# EAGLE design ig-normal-ver13_PWM_UARTexpantion (EAGLE 9.6.2)
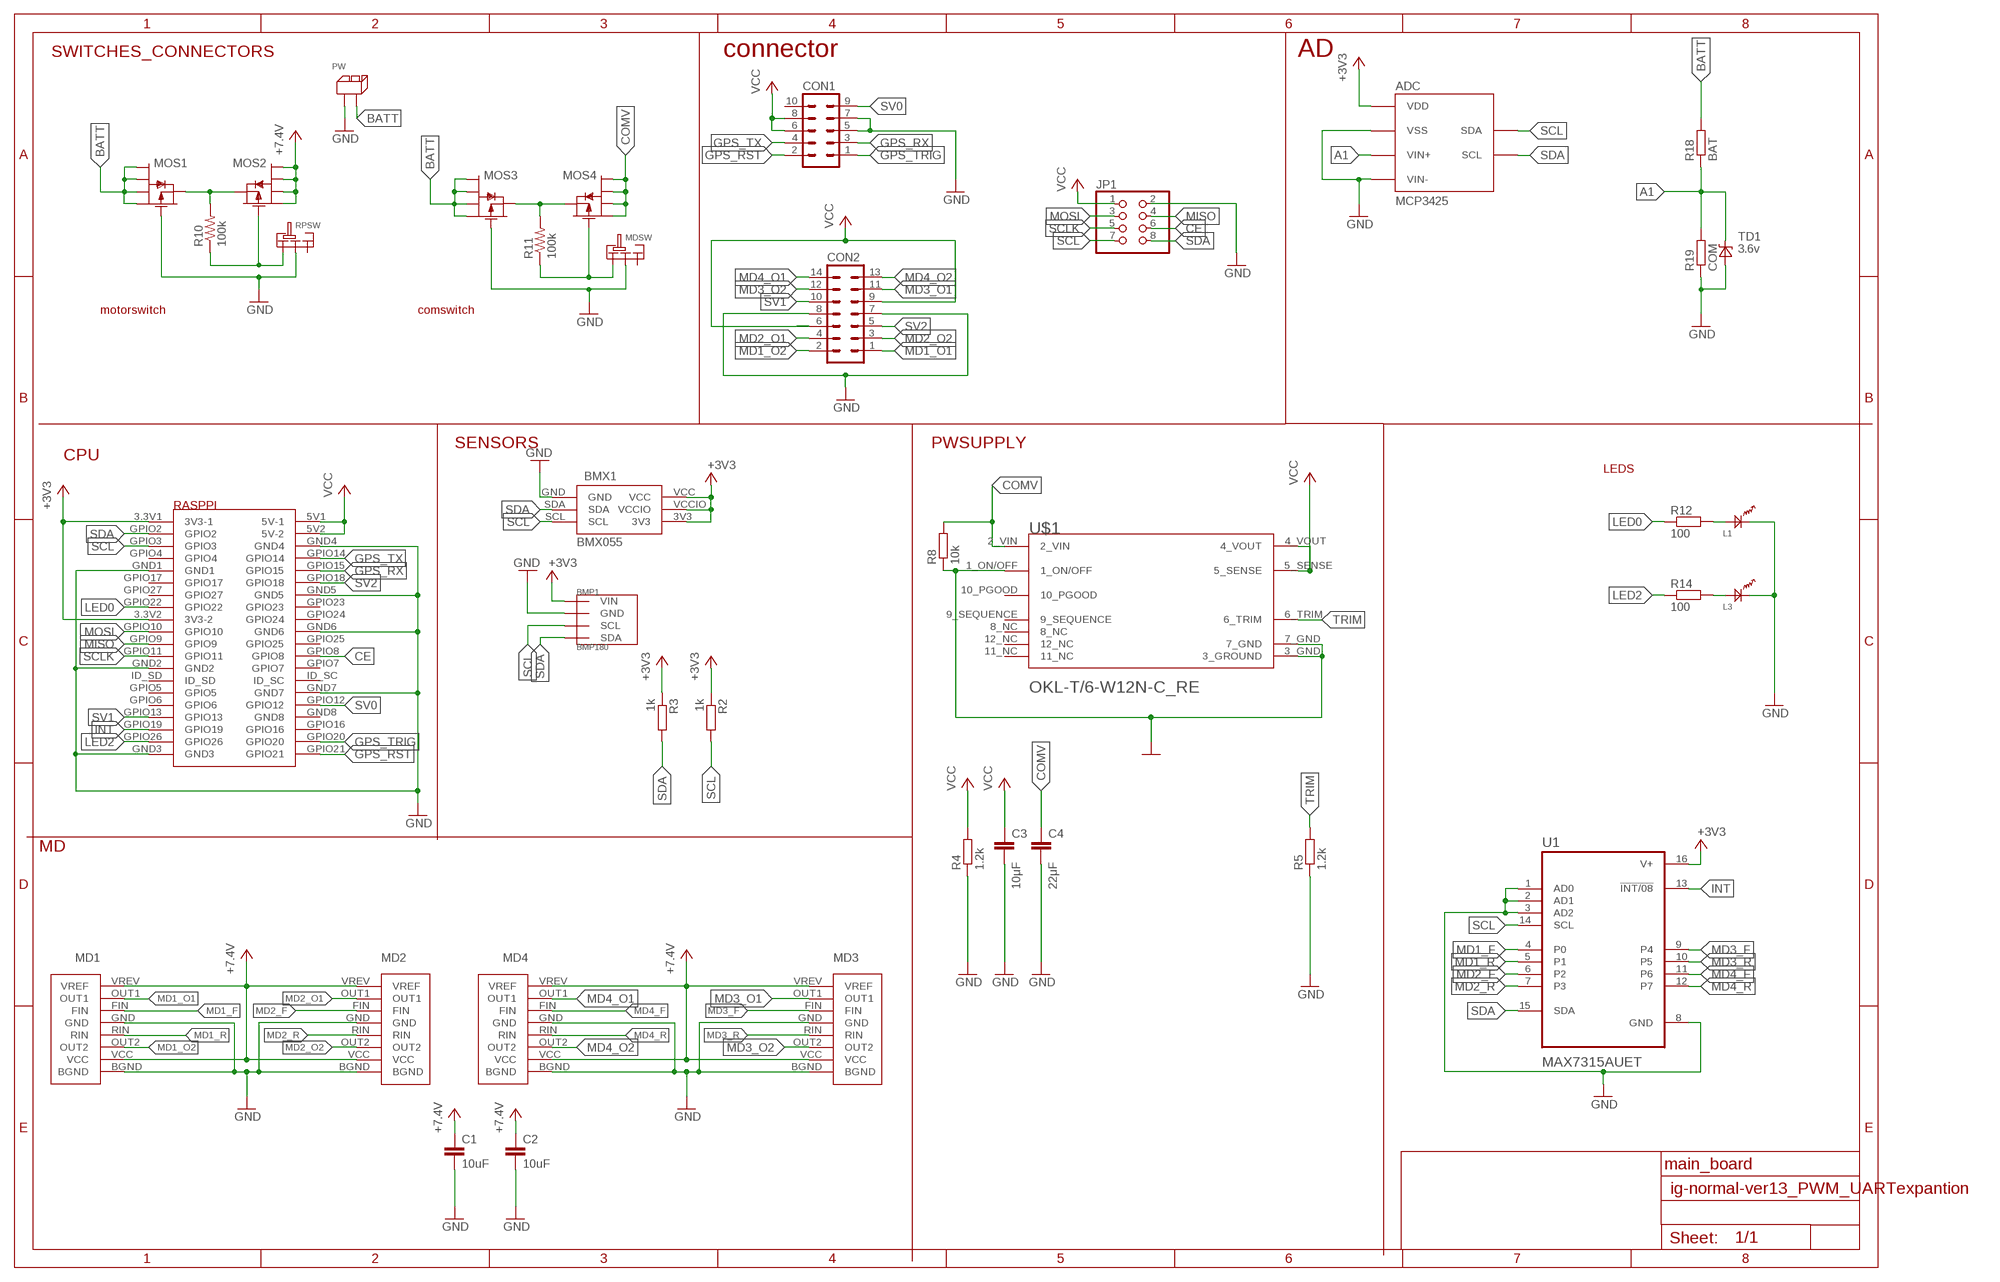
[diagram p0: schematic, sheet 1]

## Parts
ADC  MCP3425  [SOT23-6]
BMP1  BMP180  [GY-68]
BMX1  BMX055  [BMX055]
C1  10uF  C-EUC0603  [C0603]
C2  10uF  C-EUC0603  [C0603]
C3  10μF  C-EUC0603  [C0603]
C4  22μF  C-EUC0805  [C0805]
CON1  ML10L  [ML10L]
CON2  ML14L  [ML14L]
JP1  PINHD-2X4  [2X04]
L1  OSXX1608C1A  [OSXX1608C1A]
L3  OSXX1608C1A  [OSXX1608C1A]
MD1  BD6222HFP-TR  [BD6222HFP-TR]
MD2  BD6222HFP-TR  [BD6222HFP-TR]
MD3  BD6222HFP-TR  [BD6222HFP-TR]
MD4  BD6222HFP-TR  [BD6222HFP-TR]
MDSW  SRIDE_SWITCH  [SRIDE_SWITCH]
MOS1  PCH_SSM6J808R  [SSM6J808R]
MOS2  PCH_SSM6J808R  [SSM6J808R]
MOS3  PCH_SSM6J808R  [SSM6J808R]
MOS4  PCH_SSM6J808R  [SSM6J808R]
PW  2PIN  [2PIN]
R2  1k  R-EU_R0603  [R0603]
R3  1k  R-EU_R0603  [R0603]
R4  1.2k  R-EU_R0603  [R0603]
R5  1.2k  R-EU_R0603  [R0603]
R8  10k  R-EU_R0603  [R0603]
R10  100k  R-US_R0603  [R0603]
R11  100k  R-US_R0603  [R0603]
R12  100  R-EU_R0603  [R0603]
R14  100  R-EU_R0603  [R0603]
R18  BAT  R-EU_R0603  [R0603]
R19  COM  R-EU_R0603  [R0603]
RASPPI  RASPBERYPIZEROW  [RASPBERYPIZEROW]
RPSW  SRIDE_SWITCH  [SRIDE_SWITCH]
TD1  3.6v  UDZV3.6B  [UDZV3.6V]
U1  MAX7315AUET  [SOP65P640X110-16N]
U$1  OKL-T/6-W12N-C_RE  [MURATA_IKL-T-6-W12N-C_0_RECOMENDED]

## Nets
+3V3: ADC.5(VDD) BMP1.P1(VIN) BMX1.3V3 BMX1.VCC BMX1.VCCIO R2.1 R3.1 RASPPI.3.3V1(3V3-1) RASPPI.3.3V2(3V3-2) U1.16(V+)
+5V: C3.1 CON1.6 CON1.8 CON2.6 CON2.9 JP1.1 R4.2 RASPPI.5V1(5V-1) RASPPI.5V2(5V-2) U$1.4_VOUT U$1.5_SENSE ; supply symbol labelled VCC
+7.4V: C1.1 C2.1 MD1.VCC MD1.VREV(VREF) MD2.VCC MD2.VREV(VREF) MD3.VCC MD3.VREV(VREF) MD4.VCC MD4.VREV(VREF) MOS2.1 MOS2.2 MOS2.5 MOS2.6
A1: ADC.1(VIN+) R18.1 R19.2 TD1.C
BATT: MOS1.1 MOS1.2 MOS1.5 MOS1.6 MOS3.1 MOS3.2 MOS3.5 MOS3.6 PW.P$2 R18.2
CE: JP1.6 RASPPI.GPIO8
COMV: C4.1 MOS4.1 MOS4.2 MOS4.5 MOS4.6 R8.2 U$1.2_VIN
GND: ADC.2(VSS) ADC.6(VIN-) BMP1.P2(GND) BMX1.GND C1.2 C2.2 C3.2 C4.2 CON1.5 CON1.7 CON2.7 CON2.8 JP1.2 L1.CT L3.CT MD1.BGND MD1.GND MD2.BGND MD2.GND MD3.BGND MD3.GND MD4.BGND MD4.GND MDSW.LR MOS1.3 MOS3.3 PW.P$1 R4.1 R5.1 R8.1 R19.1 RASPPI.GND1 RASPPI.GND2 RASPPI.GND3 RASPPI.GND4 RASPPI.GND5 RASPPI.GND6 RASPPI.GND7 RPSW.LR TD1.A U1.1(AD0) U1.2(AD1) U1.3(AD2) U1.8(GND) U$1.1_ON/OFF U$1.3_GND(3_GROUND) U$1.7_GND
GPS_RST: CON1.2 RASPPI.GPIO21
GPS_RX: CON1.3 RASPPI.GPIO15
GPS_TRIG: CON1.1 RASPPI.GPIO20
GPS_TX: CON1.4 RASPPI.GPIO14
INT: RASPPI.GPIO19 U1.13(!INT/08)
LED0: R12.1 RASPPI.GPIO22
LED2: R14.1 RASPPI.GPIO26
MD1_F: MD1.FIN U1.4(P0)
MD1_O1: CON2.1 MD1.OUT1
MD1_O2: CON2.2 MD1.OUT2
MD1_R: MD1.RIN U1.5(P1)
MD2_F: MD2.FIN U1.6(P2)
MD2_O1: CON2.4 MD2.OUT1
MD2_O2: CON2.3 MD2.OUT2
MD2_R: MD2.RIN U1.7(P3)
MD3_F: MD3.FIN U1.9(P4)
MD3_O1: CON2.11 MD3.OUT1
MD3_O2: CON2.12 MD3.OUT2
MD3_R: MD3.RIN U1.10(P5)
MD4_F: MD4.FIN U1.11(P6)
MD4_O1: CON2.14 MD4.OUT1
MD4_O2: CON2.13 MD4.OUT2
MD4_R: MD4.RIN U1.12(P7)
MISO: JP1.4 RASPPI.GPIO9
MOSI: JP1.3 RASPPI.GPIO10
N$1: MOS3.4 MOS4.4 R11.2
N$2: MDSW.L MOS4.3 R11.1
N$3: L1.AN R12.2
N$5: L3.AN R14.2
N$6: MOS1.4 MOS2.4 R10.2
N$7: MOS2.3 R10.1 RPSW.L
SCL: ADC.4(SDA) BMP1.P3(SCL) BMX1.SCL JP1.7 R2.2 RASPPI.GPIO3 U1.14(SCL)
SCLK: JP1.5 RASPPI.GPIO11
SDA: ADC.3(SCL) BMP1.P4(SDA) BMX1.SDA JP1.8 R3.2 RASPPI.GPIO2 U1.15(SDA)
SV0: CON1.9 RASPPI.GPIO12
SV1: CON2.10 RASPPI.GPIO13
SV2: CON2.5 RASPPI.GPIO18
TRIM: R5.2 U$1.6_TRIM
Unconnected: CON1.10 MDSW.R RASPPI.GND8 RASPPI.GPIO4 RASPPI.GPIO5 RASPPI.GPIO6 RASPPI.GPIO7 RASPPI.GPIO16 RASPPI.GPIO17 RASPPI.GPIO23 RASPPI.GPIO24 RASPPI.GPIO25 RASPPI.GPIO27 RASPPI.ID_SC RASPPI.ID_SD RPSW.R U$1.8_NC U$1.9_SEQUENCE U$1.10_PGOOD U$1.11_NC U$1.12_NC

## Notes on the sheet
- SWITCHES_CONNECTORS | connector | AD
- motorswitch | comswitch
- SENSORS | PWSUPPLY
- CPU
- LEDS
- MD
- main_board

## Library data of the parts
ADC = bt:MCP3425: Microchip MCP3425 ADC The MCP3425 is a single channel low-noise, high accuracy ?? A/D converter with differential inputs and up to 16 bits of resolution in a small SOT-23-6 package. The on-board precision 2.048V reference voltage enables an input range of ±2.048V differentially (? voltage = 4.096V). The device uses a two-wire I2C compatible serial interface and operates from a single 2.7V to 5.5V power supply. The MCP3425 device performs conversion at rates of 15, 60, or 240 samples per second (SPS) depending on the user controllable configuration bit settings using the two-wire I2C serial interface Reference: http://ww1.microchip.com/downloads/en/DeviceDoc/22072a.pdf
BMP1 = BMP180:BMP180
BMX1 = BMX055:BMX055
C1-C4 = rcl:C-EU: CAPACITOR, European symbol; SPICEPREFIX: C
CON1 = con-ml:ML10L
CON2 = con-ml:ML14L
JP1 = pinhead:PINHD-2X4: PIN HEADER
L1 L3 = Chip LED:OSXX1608C1A
MD1-MD4 = BD6222HFP-TR:BD6222HFP-TR
MDSW RPSW = Sride Switch:SRIDE_SWITCH
MOS1-MOS4 = Chip MOSFET:PCH_SSM6J808R
PW = XR Connector:2PIN
R2-R5 R8 R12 R14 R18 R19 = rcl:R-EU_: RESISTOR, European symbol; SPICEPREFIX: R
R10 R11 = rcl:R-US_: RESISTOR, American symbol; SPICEPREFIX: R
RASPPI = RaspberyPiZeroW:RASPBERYPIZEROW
TD1 = Zener:UDZV3.6B
U1 = MAX7315AUET:MAX7315AUET
U$1 = OKL-T_6-W12N-C:OKL-T/6-W12N-C_RE

## Board
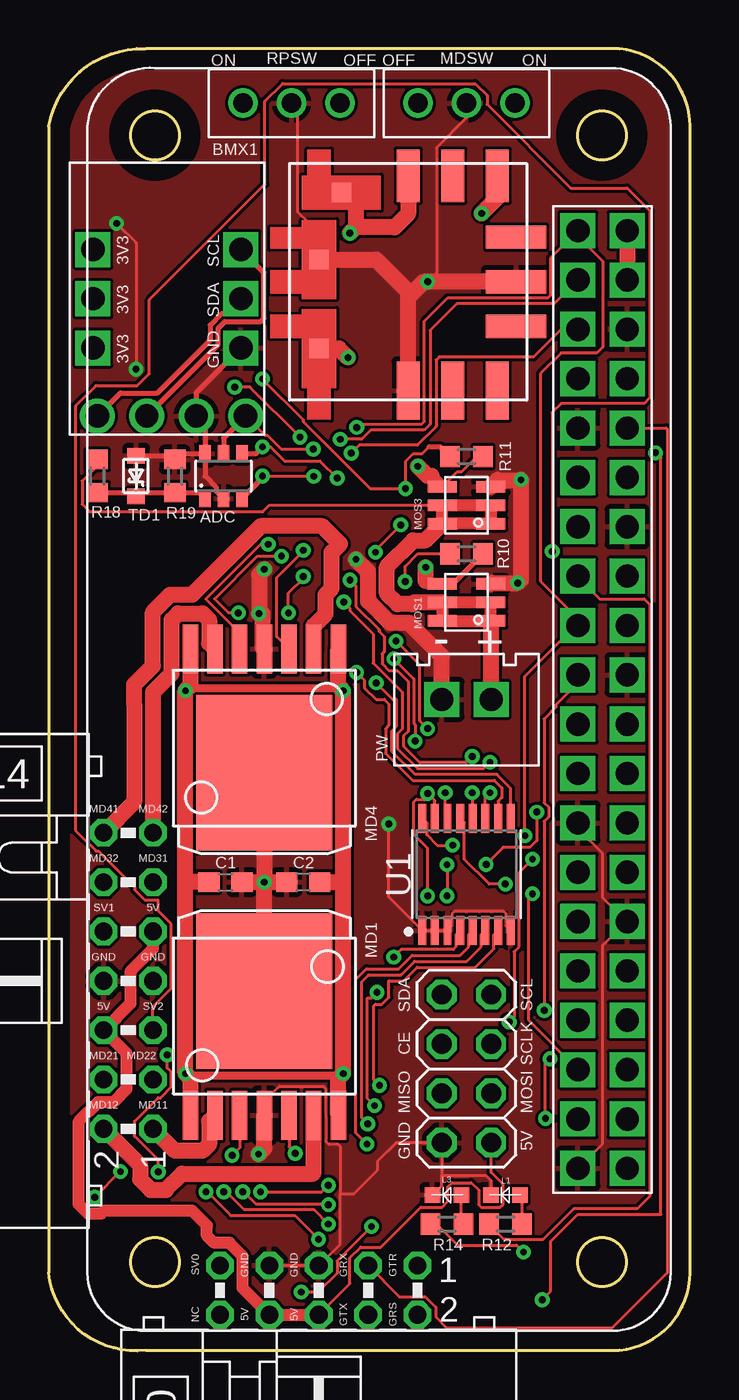
[diagram p1: board, top side]
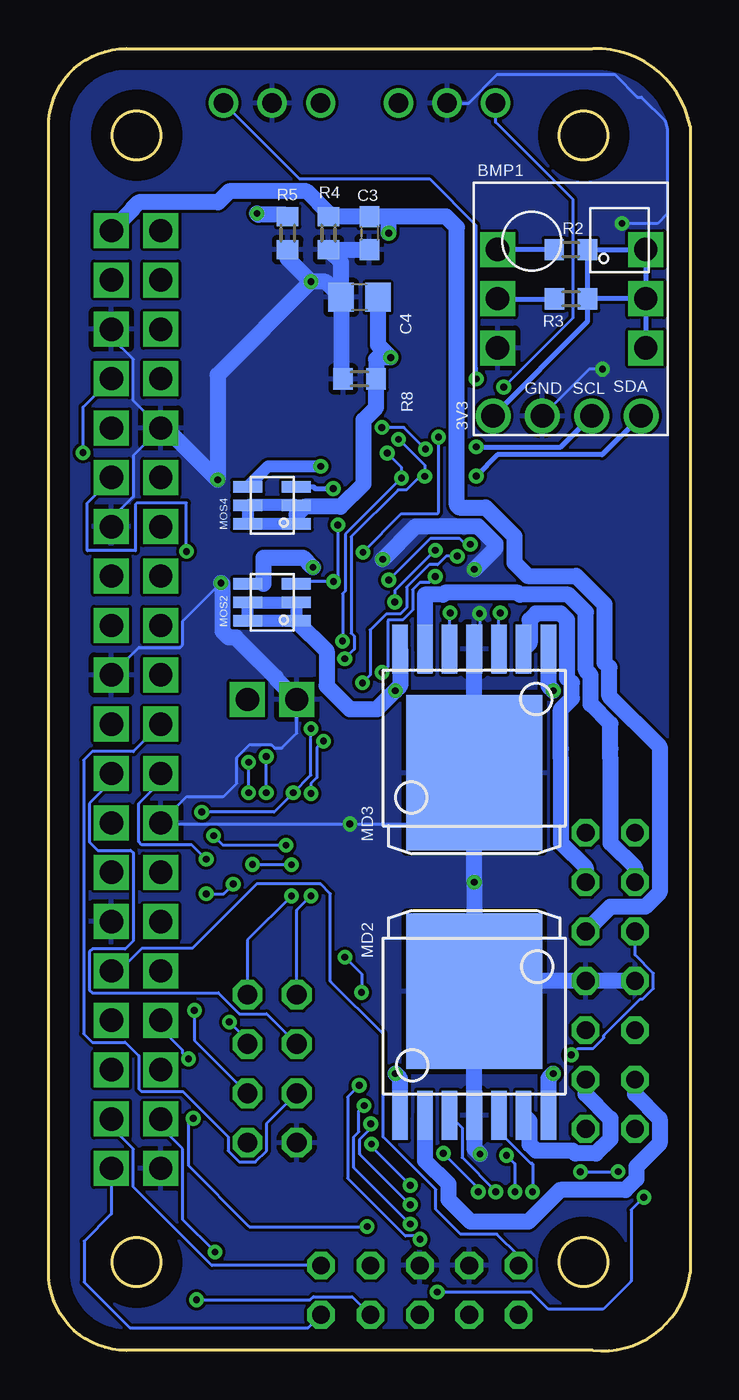
[diagram p2: board, bottom side, seen from below]

Size 33 x 67.03 mm. Coordinates in mm from the lower left corner, seen from the top.
Outline: 33,4.03 33,63.03 arc90 29,67.03 5,67.03 arc81 0,63.03 0,4.03 arc90 5,0.03 29,0.03 arc90 33,4.03
Outline: circle at 28.47,4.56 radius 1.25
Outline: circle at 5.47,4.56 radius 1.25
Outline: circle at 5.47,62.56 radius 1.25
Outline: circle at 28.47,62.56 radius 1.25
Copper layers (1*16): Top 0.035mm / dielectric 1.5mm / Bottom 0.035mm
Design rules "default *": minimum track width 6mil, minimum drill 0.35mm, track to track 6mil, track to pad 6mil, pad to pad 6mil, via to via 6mil, smd to smd 6mil, copper to edge 40mil, drill to drill 3mil, minimum pad ring 10mil, minimum via ring 8mil, stop-mask expansion 4mil, vias tented up to drill 0mil, thermal gap 10mil

### Footprints (pad centres in the part's own frame; a part is rotated, then mirrored left to right if it is on the bottom)
SOT23-6 = smd 0.6 x 0.9: 1 -0.95,-1.15; 2 0,-1.15; 3 0.95,-1.15; 4 0.95,1.15; 5 0,1.15; 6 -0.95,1.15
GY-68 = drill 1.2: P1 -5,4; P2 -5,1.46; P3 -5,-1.08; P4 -5,-3.62
BMX055 = drill 1.2 pad 1.5 square: 3V3 8.81,-9.53; GND 1.19,-4.46; SCL 1.19,-9.53; SDA 1.19,-7; VCC 8.81,-4.46; VCCIO 8.81,-7
C0603 = smd 1.1 x 1: 1 -0.85,0; 2 0.85,0
C0805 = smd 1.3 x 1.5: 1 -0.95,0; 2 0.95,0
ML10L = drill 0.914 octagon: 1 -5.08,-1.27; 2 -5.08,1.27; 3 -2.54,-1.27; 4 -2.54,1.27; 5 0,-1.27; 6 0,1.27; 7 2.54,-1.27; 8 2.54,1.27; 9 5.08,-1.27; 10 5.08,1.27
ML14L = drill 0.914 octagon: 1 -7.62,-1.27; 2 -7.62,1.27; 3 -5.08,-1.27; 4 -5.08,1.27; 5 -2.54,-1.27; 6 -2.54,1.27; 7 0,-1.27; 8 0,1.27; 9 2.54,-1.27; 10 2.54,1.27; 11 5.08,-1.27; 12 5.08,1.27; 13 7.62,-1.27; 14 7.62,1.27
2X04 = drill 1.016 octagon: 1 -3.81,-1.27; 2 -3.81,1.27; 3 -1.27,-1.27; 4 -1.27,1.27; 5 1.27,-1.27; 6 1.27,1.27; 7 3.81,-1.27; 8 3.81,1.27
OSXX1608C1A = smd 0.8 x 0.8: AN -0.75,0; CT 0.75,0
BD6222HFP-TR = smd 7 x 8: BGND 0,6.378 | smd 0.8 x 2.54: FIN -1.27,0; GND 0,0; OUT1 -2.54,0; OUT2 2.54,0; RIN 1.27,0; VCC 3.81,0; VREV -3.81,0
SRIDE_SWITCH = drill 1: L -2.5,0; LR 0,0; R 2.5,0
SSM6J808R = smd 0.6 x 1.5: 1 -0.95,-1.25; 2 0,-1.25; 3 0.95,-1.25; 4 0.95,1.25; 5 0,1.25; 6 -0.95,1.25
2PIN = drill 1.2 square: P$1 -1.27,0; P$2 1.27,0
R0603 = smd 1 x 1.1: 1 -0.85,0; 2 0.85,0
RASPBERYPIZEROW = drill 1.2 pad 1.676 square: 3.3V1 -1.27,24.13; 3.3V2 -1.27,3.81; 5V1 1.27,24.13; 5V2 1.27,21.59; GND1 -1.27,13.97; GND2 -1.27,-6.35; GND3 -1.27,-24.13; GND4 1.27,19.05; GND5 1.27,8.89; GND6 1.27,1.27; GND7 1.27,-11.43; GND8 1.27,-16.51; GPIO2 -1.27,21.59; GPIO3 -1.27,19.05; GPIO4 -1.27,16.51; GPIO5 -1.27,-11.43; GPIO6 -1.27,-13.97; GPIO7 1.27,-6.35; GPIO8 1.27,-3.81; GPIO9 -1.27,-1.27; GPIO10 -1.27,1.27; GPIO11 -1.27,-3.81; GPIO12 1.27,-13.97; GPIO13 -1.27,-16.51; GPIO14 1.27,16.51; GPIO15 1.27,13.97; GPIO16 1.27,-19.05; GPIO17 -1.27,11.43; GPIO18 1.27,11.43; GPIO19 -1.27,-19.05; GPIO20 1.27,-21.59; GPIO21 1.27,-24.13; GPIO22 -1.27,6.35; GPIO23 1.27,6.35; GPIO24 1.27,3.81; GPIO25 1.27,-1.27; GPIO26 -1.27,-21.59; GPIO27 -1.27,8.89; ID_SC 1.27,-8.89; ID_SD -1.27,-8.89
UDZV3.6V = smd 0.9 x 0.8: A 0,-1.05; C 0,1.05
SOP65P640X110-16N = smd 1.496 x 0.407: 1 -2.887,2.275; 2 -2.887,1.625; 3 -2.887,0.975; 4 -2.887,0.325; 5 -2.887,-0.325; 6 -2.887,-0.975; 7 -2.887,-1.625; 8 -2.887,-2.275; 9 2.887,-2.275; 10 2.887,-1.625; 11 2.887,-0.975; 12 2.887,-0.325; 13 2.887,0.325; 14 2.887,0.975; 15 2.887,1.625; 16 2.887,2.275
MURATA_IKL-T-6-W12N-C_0_RECOMENDED = smd 3 x 1.2: 1_ON/OFF -5.6,0; 9_SEQUENCE -5.6,-4.58; 10_PGOOD -5.6,-2.29 | smd 1 x 1: 2_VIN -3.435,4.58; 3_GND 1.145,4.58; 4_VOUT 4.585,3.435 | smd 2.7 x 1.2: 5_SENSE 5.45,0; 6_TRIM 5.45,-4.58; 11_NC 5.45,-2.29 | smd 1.2 x 3.1: 7_GND 0,-5.55; 8_NC -2.29,-5.55; 12_NC 2.29,-5.55

### Placement (x,y rotation side)
ADC  9,45.03 0 top
BMP1  6.13,53.12 90 bottom
BMX1  11.09,47.15 180 top
C1  9.1,24.13 0 top
C2  13.1,24.13 180 top
C3  16.5,57.53 270 bottom
C4  17,54.23 180 bottom
CON1  13.9,3.13 180 top
CON2  4.1,19.05 90 top
JP1  21.5,14.53 90 top
L1  23.5,8.03 180 top
L3  20.5,8.03 180 top
MD1  11.1,12.13 0 top
MD2  11.1,12.13 0 bottom
MD3  11.1,36.13 180 bottom
MD4  11.1,36.13 180 top
MDSW  21.5,64.23 180 top
MOS1  21.5,38.53 90 top
MOS2  21.5,38.53 90 bottom
MOS3  21.5,43.53 90 top
MOS4  21.5,43.53 90 bottom
PW  21.5,33.53 0 top
R2  6.13,56.68 180 bottom
R3  6.12,54.14 180 bottom
R4  18.6,57.53 90 bottom
R5  20.7,57.53 90 bottom
R8  17,50.03 0 bottom
R10  21.5,41.03 0 top
R11  21.5,46.03 0 top
R12  23.5,6.53 0 top
R14  20.5,6.53 0 top
R18  2.5,45.03 90 top
R19  6.5,45.03 270 top
RASPPI  28.5,33.53 0 top
RPSW  12.5,64.23 0 top
TD1  4.5,45.03 180 top
U1  21.5,24.53 90 top
U$1  18.5,55.03 90 top

### Tracks (layer width: path | path; a pad name or v marks a point on that pad's centre or on a via)
+3V3  (via drill 0.35 pad 0.55)
  Top 0.152: BMP1.P1 11.12,47.13 11.25,47.13 11.97,46.42 v13.61,46.42 | v15.85,47.53 16.03,47.7 19.2,47.7 19.33,47.83 19.33,52.99 20.54,54.2 25.7,54.2 25.83,54.33 25.83,56.26 RASPPI.3.3V1 27.13,57.45 28.5,56.08 28.5,51.66 28.2,51.36 26.37,51.36 25.3,50.29 25.3,39.62 27.13,37.79 27.13,37.34 | 27.13,37.34 RASPPI.3.3V2 | U1.16 19.44,27.2 19.44,26.57 19.99,26.03 v20.79,26.03 | v24.51,26.52 24.51,34.72 27.13,37.34
  Top 0.254: BMP1.P1 9,46.99 ADC.5
  Bottom 0.152: v13.61,46.42 14.72,47.53 v15.85,47.53 | v20.79,26.03 24.02,26.03 v24.51,26.52
  Bottom 0.254: BMP1.P1 5.27,52.99 R3.1 | R3.1 R2.1 BMX1.3V3 BMX1.VCCIO | BMX1.VCCIO 5.26,54.15 R3.1 | BMX1.VCCIO BMX1.VCC
+5V  (via drill 0.35 pad 0.55)
  Top 0.152: CON1.6 15.5,3.46 15.5,4.79 16.05,5.34 17.09,5.34 19.15,7.4 20.24,7.4 20.54,7.69 20.54,8.43 20.75,8.66 21.75,8.66 22.12,8.28 22.12,7.53 22.25,7.4 23.25,7.4 23.38,7.53 23.38,8.58 22.77,9.19 JP1.1
  Top 0.61: CON1.6 CON1.8 9.99,3.23 9.99,4.88 9.3,5.56 8.5,5.56 8.14,5.93 8.14,6.46 7.36,7.23 2.88,7.23 2.72,7.07 2.03,7.07 1.54,7.56 1.54,11.79 2.55,12.8 3.31,12.8 4,13.48 4,15.34 CON2.6 4.2,17.88 4.2,19.53 5.37,20.7 CON2.9
  Top 0.813: RASPPI.5V1 RASPPI.5V2 | 15.8,57.83 v15.5,57.53 | 15.8,57.83 17.8,57.83 18.5,58.53 U$1.5_SENSE | U$1.4_VOUT 15.8,58.88 15.8,57.83
  Bottom 0.813: RASPPI.5V1 28.69,58.74 28.69,58.79 28.36,59.12 24.28,59.12 23.71,59.69 19.72,59.69 18.6,58.57 R4.2 C3.1 15.5,58.38 | 15.5,58.38 12.55,58.38 12,57.83 12,43.53 11.88,43.42 10.52,43.42 9.04,41.93 9.04,40.57 8.35,39.89 5.86,39.89 4.39,38.42 4.39,35.43 4.15,35.18 4.15,33.68 1.56,31.1 1.56,23.6 2.3,22.86 4.1,22.86 CON2.9 | v15.5,57.53 15.5,58.38
+7.4V  (via drill 0.35)
  Top 0.406: v15.16,33.98 14.87,33.98 14.75,34.1 7.45,34.1 7.33,33.98 v7.04,33.98 | v15.16,14.27 14.87,14.27 14.75,14.15 7.45,14.15 7.33,14.27 v7.04,14.27
  Top 0.813: MD4.VCC 7.29,34.23 v7.04,33.98 7.04,24.13 | MD2.VCC 7.29,14.02 v7.04,14.27 7.04,24.13 | MD1.VCC 14.91,14.02 v15.16,14.27 15.16,24.13 | MD3.VCC 14.91,34.23 v15.16,33.98 15.16,24.13 | C2.1 15.16,24.13 | C1.1 7.04,24.13
  Bottom 0.61: MOS2.1 MOS2.6 MOS2.5 MOS2.2 MOS2.1
  Bottom 0.813: MD4.VCC 7.29,34.23 v7.04,33.98 | v7.04,14.27 7.29,14.02 MD2.VCC | MD1.VCC 14.91,14.02 v15.16,14.27 | MD3.VCC 14.91,34.23 v15.16,33.98 16.11,33.03 17.5,33.03 18.7,34.23 18.7,36.03 MOS2.1
A1
  Top 0.254: R18.1 4.3,44.18 TD1.C 4.7,44.18 R19.2 7.75,44.18 ADC.1
BATT
  Top 0.152: MOS3.5 11.36,43.53 11.03,43.2 2.11,43.2 1.72,43.58 1.72,44.77 2.5,45.55 R18.2
  Top 0.61: MOS1.6 MOS1.1 MOS1.2 MOS1.5 MOS1.6 | MOS3.1 MOS3.6 MOS3.5 MOS3.2 MOS3.1
  Top 0.813: PW.P$2 22.77,37.56 MOS1.1 | MOS1.5 18.82,38.53 18.73,38.43 17.95,38.43 17.41,38.98 17.41,40.36 18.76,41.71 19.39,41.71 MOS3.6
CE
  Bottom 0.152: RASPPI.GPIO8 29.77,29.3 30.9,28.17 30.9,26.18 30.48,25.77 28.77,25.77 28.64,25.63 28.64,21.1 29.06,20.69 30.77,20.69 30.9,20.55 30.9,18.56 30.77,18.43 24.26,18.43 23.18,17.35 21.78,17.35 JP1.6
COMV  (via drill 0.35 pad 0.55)
  Top 0.813: U$1.2_VIN 14.94,51.59 v15.4,51.13
  Bottom 0.61: MOS4.1 20.25,43.03 MOS4.2 MOS4.5 MOS4.6 MOS4.1
  Bottom 0.813: 20.25,43.03 19.83,43.45 17.97,43.45 16.79,44.62 16.79,47.91 16.15,48.56 R8.2 16.15,51.03 16.05,51.13 v15.4,51.13 16.05,51.78 C4.1
GND  (via drill 0.35, 0.35 pad 0.55)
  Top 0.152: U$1.3_GND 14.24,56.49 14.49,56.49 14.63,56.62 14.63,57.92 14.49,58.06 13.38,58.06 12.8,58.63 12.8,63.93 RPSW.LR | MDSW.LR 21.5,63.46 19.96,61.92 19.96,55.49 v19.5,55.03 | v3.5,58.03 4.5,57.03 v4.5,50.53 | 15,8.08 15,10.53 14.9,10.63 14.41,10.63 14.28,10.77 14.28,13.48 14.13,13.63 11.88,13.63 11.1,12.85 MD1.GND | 15,8.08 15.7,8.08 16.92,9.29 16.92,9.75 17.88,10.72 JP1.2 20.23,9.03 | L1.CT 22.75,8.04 22.75,8.77 22.5,9.03 20.23,9.03 | 29.72,22.1 28.5,23.32 28.5,25.6 27.28,26.82 27.28,27.13 RASPPI.GND2 | 29.72,22.1 28.5,20.88 28.5,10.67 RASPPI.GND3 | 29.72,22.1 RASPPI.GND7 | v10.83,37.95 11,37.95 | 15,8.08 15,5.5 CON1.5 CON1.7 | U1.8 23.56,21.86 23.56,22.48 23.42,22.62 20.88,22.62 20.74,22.48 20.74,21.86 U1.3 U1.2 U1.1 17.5,23.36 v17.5,27.13 | 20.23,9.03 20.23,8.51 L3.CT
  Top 0.254: TD1.A 6.3,46.08 R19.1 6.8,46.18 ADC.6 | ADC.2 8.63,44.25 8.63,44.44 8.05,45.02 ADC.6 | BMX1.GND 7.59,49.31 BMP1.P2 8.05,47.67 ADC.6
  Top 0.813: MD1.BGND v11.1,24.13 | MD4.BGND v11.1,24.13 | C1.2 v11.1,24.13 | v11.1,24.13 C2.2 | U$1.7_GND v19.5,55.03 19.3,55.03 18.5,54.23 | U$1.1_ON/OFF 18.5,54.23 | 18.5,54.23 18.5,54.53 16.86,56.17 U$1.3_GND | 11,37.95 11,36.23 MD4.GND | MOS1.3 22.8,39.53 v24.13,39.53 24.3,39.7 v24.3,44.83 23.1,44.83 MOS3.3 | PW.P$1 20.23,35.76 18.52,37.47 17.55,37.47 16.44,38.58 16.44,40.11 v15.81,40.74 | v11.1,40.23 10.83,39.95 v10.83,37.95 | v10.8,10.13 11.1,10.43 MD1.GND
  Bottom 0.152: RPSW.LR 11.39,64.23 9.92,65.69 3.88,65.69 2.71,64.53 2.5,64.53 1.29,63.31 1.17,62.88 1.17,58.53 1.67,58.03 v3.5,58.03 | v4.5,50.53 5.19,50.53 BMP1.P2 | RASPPI.GND4 29.77,52.16 28.64,51.03 28.64,48.91 RASPPI.GND1 28.64,46.09 28.64,43.96 29.77,42.83 RASPPI.GND5 | MD4.BGND 11.43,27.13 v17.5,27.13 27.13,27.13 RASPPI.GND2 25.88,28.53 24,28.53 23.32,29.21 23.32,30.55 22.66,31.2 21.55,31.2 21.37,31.03 21,31.03 20.23,31.8 PW.P$1 | MD4.GND 10.83,36.4 v10.83,37.95 | RASPPI.GND6 28.36,36.21 26.23,36.21 26.1,36.34 26.1,37.56 v24.13,39.53
  Bottom 0.813: MD1.BGND v11.1,24.13 MD4.BGND MD4.GND | PW.P$1 21.31,34.61 21.31,34.66 23.37,36.72 23.73,36.72 24.06,37.05 24.06,39.45 v24.13,39.53 | v15.81,40.74 14.1,42.45 10.92,42.45 10,41.53 10,41.33 v11.1,40.23 | RASPPI.GND1 26.97,47.5 v24.3,44.83 24.3,50.23 v19.5,55.03 | C4.2 18.75,55.03 v19.5,55.03 | C3.2 16.6,56.58 16.7,56.68 R4.1 17.95,56.03 C4.2 | MD1.BGND MD1.GND 11.1,11.75 11.09,11.75 11.09,10.42 v10.8,10.13 | CON2.8 CON2.7 10.56,19.05 MD1.BGND | R5.1 20.7,56.23 v19.5,55.03 | C4.2 17.95,50.13 R8.1
  pour Bottom: -1.98,69.09 36.12,69.09 36.12,-2.03 -1.98,-2.03
  pour Top: -1.98,69.09 36.12,69.09 36.12,-2.03 -1.98,-2.03
GPS_RST
  Bottom 0.152: RASPPI.GPIO21 29.77,7.04 31.17,5.65 31.17,3.54 28.83,1.2 28.82,1.19 19.64,1.19 CON1.2
GPS_RX
  Top 0.152: RASPPI.GPIO15 31.77,47.5 31.83,47.43 31.83,4.03 29,1.19 20.47,1.19 19.92,1.75 19.92,2.25 19.37,2.8 18.04,2.8 CON1.3
GPS_TRIG
  Bottom 0.152: RASPPI.GPIO20 29.77,11.52 28.64,10.39 28.64,8.44 24.6,4.4 CON1.1
GPS_TX  (via drill 0.35 pad 0.55)
  Top 0.152: v25.39,2.63 25.83,3.07 25.83,5.63 27.23,7.03 31.5,7.03 31.5,45.95 v31.23,46.23
  Bottom 0.152: v31.23,46.23 31.23,48.58 RASPPI.GPIO14 | CON1.4 17.38,2.8 19.37,2.8 19.53,2.63 v25.39,2.63
INT  (via drill 0.35)
  Top 0.152: U1.13 21.39,27.2 21.39,25.3 22.66,24.03 v23.5,24.03 | RASPPI.GPIO19 24.71,17 24.71,23.34 v24.89,23.53
  Bottom 0.152: v24.89,23.53 24,23.53 v23.5,24.03
LED0
  Top 0.152: RASPPI.GPIO22 27.28,39.77 28.35,38.71 30.63,38.71 30.94,38.4 30.94,7.96 30.3,7.33 27.04,7.33 25.45,5.75 23.5,5.75 23.43,5.75 R12.1
LED2  (via drill 0.35)
  Top 0.152: v24.43,5.09 24.08,5.44 21.06,5.44 19.98,6.53 R14.1
  Bottom 0.152: RASPPI.GPIO26 27.23,11.52 26.1,10.39 26.1,6.76 v24.43,5.09
MD1_F  (via drill 0.35 pad 0.55)
  Top 0.152: MD1.FIN 9.83,10.45 v9.44,10.06 | v9.01,8.19 9.13,8.19 10.05,7.28 13.64,7.28 v14.39,6.53 | v16.77,12.63 16.4,12.99 16.4,18.15 16.6,18.15 v16.9,18.45 | U1.4 20.96,21.42 20.96,20.8 20.82,20.66 18.15,20.66 v17.76,20.27
  Bottom 0.152: v9.44,10.06 9.01,9.63 v9.01,8.19 | v17.76,20.27 16.9,19.41 v16.9,18.45 | v14.39,6.53 17.29,9.43 17.29,11.02 17.03,11.28 17.03,12.37 v16.77,12.63
MD1_O1
  Top 0.813: MD1.OUT1 8.25,11.82 8.25,10.63 7.92,10.3 6.5,10.3 CON2.1
MD1_O2
  Top 0.813: MD1.OUT2 13.64,9.17 13.6,9.13 6.87,9.13 6.03,8.28 5.25,8.28 4.7,8.83 4.7,9.55 CON2.2
MD1_R  (via drill 0.35 pad 0.55)
  Top 0.152: MD1.RIN 12.37,10.48 v12.69,10.16 | v14.39,8.53 14.06,8.19 v10.9,8.19 | v16.38,10.64 15.79,11.23 15.79,19.11 16.34,19.66 18.01,19.66 18.7,20.36 21.17,20.36 21.61,20.8 21.61,21.42 U1.5
  Bottom 0.152: v12.69,10.16 10.9,8.38 v10.9,8.19 | v14.39,8.53 16.38,10.52 v16.38,10.64
MD2_F  (via drill 0.35 pad 0.55)
  Top 0.152: v9.99,8.19 10.04,8.19 10.65,7.58 14.34,7.58 v14.39,7.53 | v16.43,11.69 16.1,12.01 16.1,18.99 16.47,19.36 18.13,19.36 18.83,20.05 21.51,20.05 22.26,20.8 22.26,21.42 U1.6
  Bottom 0.152: MD2.FIN 11.73,11.49 11.73,9.96 9.99,8.22 v9.99,8.19 | v16.43,11.69 16.43,11.46 16.99,10.9 16.99,10.12 v14.39,7.53
MD2_O1
  Bottom 0.813: MD2.OUT1 13.64,9.79 12.44,8.59 12.44,7.8 11.29,6.65 8.31,6.65 6.68,8.28 3.32,8.28 2.76,8.84 2.76,9.48 1.56,10.68 1.56,11.95 2.83,13.22 CON2.4
MD2_O2
  Bottom 0.813: MD2.OUT2 8.25,11.82 8.25,10.63 7.92,10.3 6.04,10.3 5.9,10.16 4.84,10.16 4.1,10.9 4.1,11.95 5.37,13.22 CON2.3
MD2_R  (via drill 0.35 pad 0.55)
  Top 0.152: v8.1,8.19 8.15,8.19 9.37,6.97 12.66,6.97 v13.89,5.74 | v17.02,13.66 16.71,13.97 16.71,17.73 16.82,17.84 17.15,17.84 17.51,18.2 17.51,18.7 17.5,18.71 17.5,19.03 17.53,19.05 18.26,19.05 18.96,19.75 21.95,19.75 22.91,20.7 22.91,21.42 U1.7
  Bottom 0.152: MD2.RIN 9.83,11.31 8.18,9.66 8.14,9.66 8.1,9.63 v8.1,8.19 | v13.89,5.74 14.06,5.92 14.64,5.92 17.62,8.89 17.62,13.06 v17.02,13.66
MD3_F  (via drill 0.35 pad 0.55)
  Top 0.152: v11.98,40.9 10.75,40.9 8.55,38.7 9.26,37.98 v9.76,37.98 | v16.86,34.38 17.71,33.53 17.88,33.53 17.88,32.13 17.64,31.89 17.64,30.88 18.85,29.67 23.06,29.67 23.77,28.95 U1.9
  Bottom 0.152: MD3.FIN 9.83,37.92 v9.76,37.98 | v11.98,40.9 12.55,40.9 12.99,40.46 13.43,40.46 14.58,39.31 14.58,38.25 14.9,37.93 15.63,37.93 16.45,37.1 16.45,34.78 v16.86,34.38
MD3_O1
  Bottom 0.813: MD3.OUT1 8.25,36.43 8.25,37.62 7.92,37.96 6.66,37.96 6.32,37.62 6.32,34.63 6.08,34.38 6.08,33.58 6.64,33.02 6.64,30.99 6.64,30.48 6.64,26.14 5.37,24.87 CON2.11
MD3_O2
  Bottom 0.813: MD3.OUT2 13.64,38.92 12.71,38.92 12.61,39.03 8.86,39.03 8.75,38.92 6.26,38.92 5.36,38.02 5.36,35.03 5.11,34.78 5.11,33.28 4.1,32.27 4.1,30.99 4.1,30.48 4.1,26.14 2.83,24.87 CON2.12
MD3_R  (via drill 0.35 pad 0.55)
  Top 0.152: v12.34,37.98 12.34,39 13.1,39.76 v13.1,39.86 | v15.85,34.92 16.25,34.52 16.25,34.13 16.85,33.53 17.28,33.53 17.5,33.31 17.5,32.18 17.34,32.01 17.34,30.75 18.73,29.36 22.93,29.36 23.32,28.98 23.32,28.48 23.12,28.28 U1.10
  Bottom 0.152: MD3.RIN 12.37,37.96 v12.34,37.98 | v13.1,39.86 13.4,39.56 13.9,39.56 14.28,39.18 14.28,38.13 14.78,37.63 15.5,37.63 15.55,37.58 15.55,35.22 v15.85,34.92
MD4_F  (via drill 0.35 pad 0.55)
  Top 0.152: MD4.FIN 11.73,36.76 11.73,39.8 13.1,41.16 v13.1,41.21 | v15.19,38.54 15.5,38.22 15.5,38.1 16.7,36.9 16.7,35.4 18.19,33.91 18.19,32 17.95,31.76 17.95,31.01 18.98,29.97 22.38,29.97 v22.71,30.3 | U1.11 22.48,28.49 v22.71,28.73
  Bottom 0.152: v13.1,41.21 13.11,41.21 15.19,39.13 v15.19,38.54 | v22.71,28.73 v22.71,30.3
MD4_O1
  Top 0.813: MD4.OUT1 13.64,37.32 14.25,37.93 14.25,38.93 14.57,39.24 14.57,41.09 15,41.53 14.08,42.45 10.91,42.45 7.39,38.92 6.26,38.92 5.36,38.02 5.36,35.25 4.41,34.3 4.41,33.53 4.41,33.32 4.41,28.24 CON2.14
MD4_O2
  Top 0.813: MD4.OUT2 8.25,36.43 8.25,37.62 7.92,37.96 6.66,37.96 6.32,37.62 6.32,34.85 5.37,33.9 CON2.13
MD4_R  (via drill 0.35 pad 0.55)
  Top 0.152: MD4.RIN 9.83,36.96 8.09,38.7 10.9,41.51 v11.3,41.51 | v15.5,39.68 15.8,39.37 15.8,38.32 17,37.12 17,37.03 17.27,36.76 17.27,35.99 17.16,35.87 17.16,35.37 17.51,35.01 17.94,35.01 18.49,34.46 18.49,31.88 18.25,31.64 18.25,31.13 19.11,30.28 21.48,30.28 v21.8,30.6 | U1.12 21.82,28.7 v21.8,28.73
  Bottom 0.152: v11.3,41.51 11.54,41.51 11.85,41.82 13.36,41.82 v15.5,39.68 | v21.8,28.73 v21.8,30.6
MISO
  Bottom 0.152: RASPPI.GPIO9 28.64,30.85 30.77,30.85 31.2,30.41 31.2,16.33 30.77,15.89 29.06,15.89 28.36,15.19 28.36,13.48 28.23,13.35 26.09,13.35 23.76,11.02 23.76,10.31 23.18,9.73 22.36,9.73 21.78,10.31 21.78,11.71 JP1.4
MOSI  (via drill 0.35)
  Top 0.152: RASPPI.GPIO10 27.23,34.38 26.1,33.25 26.1,33.13 25.5,32.53 25.5,28.21 25.72,27.98 25.72,27.48 25.5,27.26 v25.5,17.53
  Bottom 0.152: v25.5,17.53 25.5,15.99 JP1.3
N$1  (via drill 0.35)
  Top 0.152: R11.2 22.02,46.03 21.25,45.25 21.02,45.25 MOS3.4
  Top 0.61: MOS3.4 19.7,45.03
  Top 0.813: 19.7,45.03 19.5,45.03 v19,45.53
  Bottom 0.61: v19,45.53 v19.01,45.53 21.69,45.53 MOS4.4
N$2  (via drill 0.35, 0.35 pad 0.55)
  Top 0.152: v11,50.03 13.09,47.94 13.09,47.83 16.54,44.38 v18.36,44.38 18.36,45.78 18.74,46.16 19.2,46.16 19.57,46.53
  Top 0.254: R11.1 20.15,46.53 19.57,46.53
  Bottom 0.152: MDSW.L 20.09,60.32 13.4,60.32 11.03,57.95 11.03,50.62 11,50.59 v11,50.03
  Bottom 0.254: v18.36,44.38 18.71,44.38 18.73,44.37 19.27,44.37 19.38,44.48 MOS4.3
N$3
  Top 0.152: L1.AN 24.35,7.93 R12.2
N$5
  Top 0.152: L3.AN 21.23,7.89 21.23,6.67 R14.2
N$6  (via drill 0.35)
  Top 0.254: MOS1.4 20.8,39.48 R10.2
  Top 0.61: MOS1.4 19.55,39.48 19.4,39.63
  Top 0.813: 19.4,39.63 v19.4,40.33
  Bottom 0.61: 21.95,39.48 MOS2.4
  Bottom 0.813: v19.4,40.33 19.9,40.83 21.95,40.83 21.95,39.48
N$7  (via drill 0.35, 0.35 pad 0.55)
  Top 0.152: v12.94,47.03 10.36,49.61 v9.58,49.61 | v18.12,42.51 16.82,41.22 v16.82,41.11 | v18.34,39.59 18.34,40.37 19,41.03 R10.1
  Bottom 0.152: v12.94,47.03 12.94,43.15 13,43.09 14.84,43.09 v16.82,41.11 | v9.58,49.61 6.01,53.17 6.01,59.24 10,63.23 RPSW.L | v18.12,42.51 18.12,39.59 v18.34,39.59 20.13,39.59 MOS2.3
SCL  (via drill 0.35, 0.35 pad 0.55)
  Top 0.152: v15.57,46.21 15.98,46.61 18.97,46.61 19.94,47.58 19.94,51 20.09,51.16 24.94,51.16 26.36,52.58 RASPPI.GPIO3 | v11,46.53 11.43,46.53 12.14,45.81 13.96,45.81 v14.85,44.92 | v17.88,36.53 19.1,35.31 19.1,32.43 v19.5,32.03 | U1.14 20.41,27.53 v20.41,28.73 | v22.51,25.04 23.39,25.91 24.76,25.91 25.12,26.27 v25.12,27.73 | v20.5,25.03 v20.5,23.42
  Top 0.254: BMP1.P3 8.72,51.79 8.72,52.63 9.06,52.98 10.91,52.98 10.96,53.03 11,53.03 11,53.06 11.08,53.14 11.08,55.51 BMX1.SCL | ADC.4 10.65,46.18 v11,46.53
  Bottom 0.152: v15.57,46.21 14.85,45.48 v14.85,44.92 17.73,42.03 17.73,39.12 17.88,38.97 v17.88,36.53 | v19.5,32.03 19.5,29.64 v20.41,28.73 21.4,27.73 v25.12,27.73 | v22.51,25.04 v22.5,25.03 v20.5,25.03 | v20.5,23.42 22.77,21.15 JP1.7
  Bottom 0.254: R2.2 BMX1.SCL | v11,46.53 6.65,46.53 BMP1.P3
SCLK  (via drill 0.35)
  Top 0.152: v23.7,16.93 23.95,17.18 23.95,20.54 24.21,20.8 24.21,24.62 v24.89,25.31
  Bottom 0.152: JP1.5 22.77,16 v23.7,16.93 | v24.89,25.31 25.64,26.05 28.23,26.05 28.36,26.18 28.36,28.17 27.23,29.3 RASPPI.GPIO11
SDA  (via drill 0.35, 0.35 pad 0.55)
  Top 0.152: RASPPI.GPIO2 26.01,53.89 21,53.89 19.63,52.53 19.63,47.71 19.32,47.39 16.58,47.39 16.11,46.92 v15,46.92 | v13.64,45.01 11.02,45.01 v11,45.03 | v17.76,35.62 18.8,34.59 18.8,32.3 18.86,32.24 v18.86,31.38 | U1.15 19.88,28.32 19.58,28.61 | 19.58,28.61 v19.5,28.69 | 19.58,28.61 19.36,28.39 18.93,28.39 18.79,28.26 18.79,26.57 19.5,25.86 v19.5,23.42
  Top 0.254: BMX1.SDA 9.12,53.38 8.89,53.38 8.31,52.8 8.31,52.03 5.59,49.3 3.69,49.3 BMP1.P4 | v11,45.03 11,44.93 ADC.3
  Bottom 0.152: v15,46.92 14.97,46.92 13.64,45.59 v13.64,45.01 13.9,45.01 14.59,44.32 15.02,44.32 17.43,41.91 17.43,36.94 17.27,36.78 17.27,36.11 v17.76,35.62 | v18.86,31.38 19.2,31.05 19.2,29.51 19.5,29.2 v19.5,28.69 | JP1.8 20.23,22.69 v19.5,23.42
  Bottom 0.254: BMX1.SDA 9.88,54.14 R3.2 | BMP1.P4 4.52,46.12 9.91,46.12 v11,45.03
SV0
  Bottom 0.152: RASPPI.GPIO12 29.72,19.66 29.26,19.66 28.2,20.72 25.6,20.72 22.3,24.03 19,24.03 18.5,23.53 18.5,19.03 15.79,16.32 15.79,11.02 13.08,8.3 13.08,7.29 11.8,6.01 9.93,6.01 8.82,4.9 CON1.9
SV1  (via drill 0.35)
  Top 0.152: v16.61,6.4 14.84,4.63 14.84,4.01 13.86,3.03 v13,3.03 | v25.56,11.96 25.56,14.79 v25.8,15.03 | v6.1,15.24 6.1,14.56 6.31,14.36 6.31,13.58 5.76,13.03 5.64,13.03 4.43,11.82 4.43,11.04 5.64,9.83 v5.64,9.22 | v3.7,9.23 v2.37,7.91
  Bottom 0.152: v16.61,6.4 22.67,6.4 25.8,9.53 25.8,11.73 v25.56,11.96 | v25.8,15.03 26.1,15.33 26.1,15.47 27.23,16.6 RASPPI.GPIO13 | v6.1,15.24 5.78,15.57 4.98,15.57 4.43,16.12 4.43,16.24 2.56,18.11 2.44,18.11 1.89,18.66 1.89,19.44 2.83,20.38 CON2.10 | v5.64,9.22 3.71,9.22 v3.7,9.23 | v2.37,7.91 3.03,7.25 3.03,3.59 4.47,2.15 7.29,2.15 8.17,3.03 v13,3.03
SV2  (via drill 0.35)
  Top 0.152: v25.91,41.15 25.91,48.31 26.37,48.77 30.63,48.77 30.94,49.07 30.94,58.67 29.76,59.85 26.87,59.85 22.56,64.16 22.56,64.62 21.95,65.23 12.04,65.23 11.13,64.31 11.13,60.04 5.18,54.1 5.18,50.29 4.57,49.68 2.44,49.68 1.37,48.61 1.37,26.79 2.44,25.73 2.56,25.73 4.43,23.86 4.43,23.74 4.98,23.19 5.64,23.19 5.64,22.65 6.31,21.98 6.31,18.66 5.37,17.72 CON2.5
  Bottom 0.152: RASPPI.GPIO18 29.73,44.92 31,43.65 31,41.19 28.54,41.19 28.54,43.57 28.46,43.65 25.91,43.65 v25.91,41.15
TRIM  (via drill 0.35 pad 0.55)
  Top 0.813: U$1.6_TRIM 23.08,59.35 v22.28,58.55
  Bottom 0.813: v22.28,58.55 22.21,58.48 20.8,58.48 R5.2

### Text on the board
tPlace: ON | OFF | OFF | ON | 3V3 | SCL | 3V3 | SDA | 3V3 | GND | - | + | MD41 | MD42 | MD32 | MD31 | SV1 | 5V | GND | GND | SDA | SCL | 5V | SV2 | MD21 | MD22 | CE | SCLK | MISO | MOSI | MD12 | MD11 | GND | 5V | SV0 | GND | GND | GRX | GTR | NC | 5V | 5V | GTX | GRS
bPlace: SDA | SCL | GND | 3V3